# EAGLE design atum (EAGLE 6.5.0)
AUTHOR: Brad Campbell; REV: A; TITLE: Atum

## Sheet 1 of 2
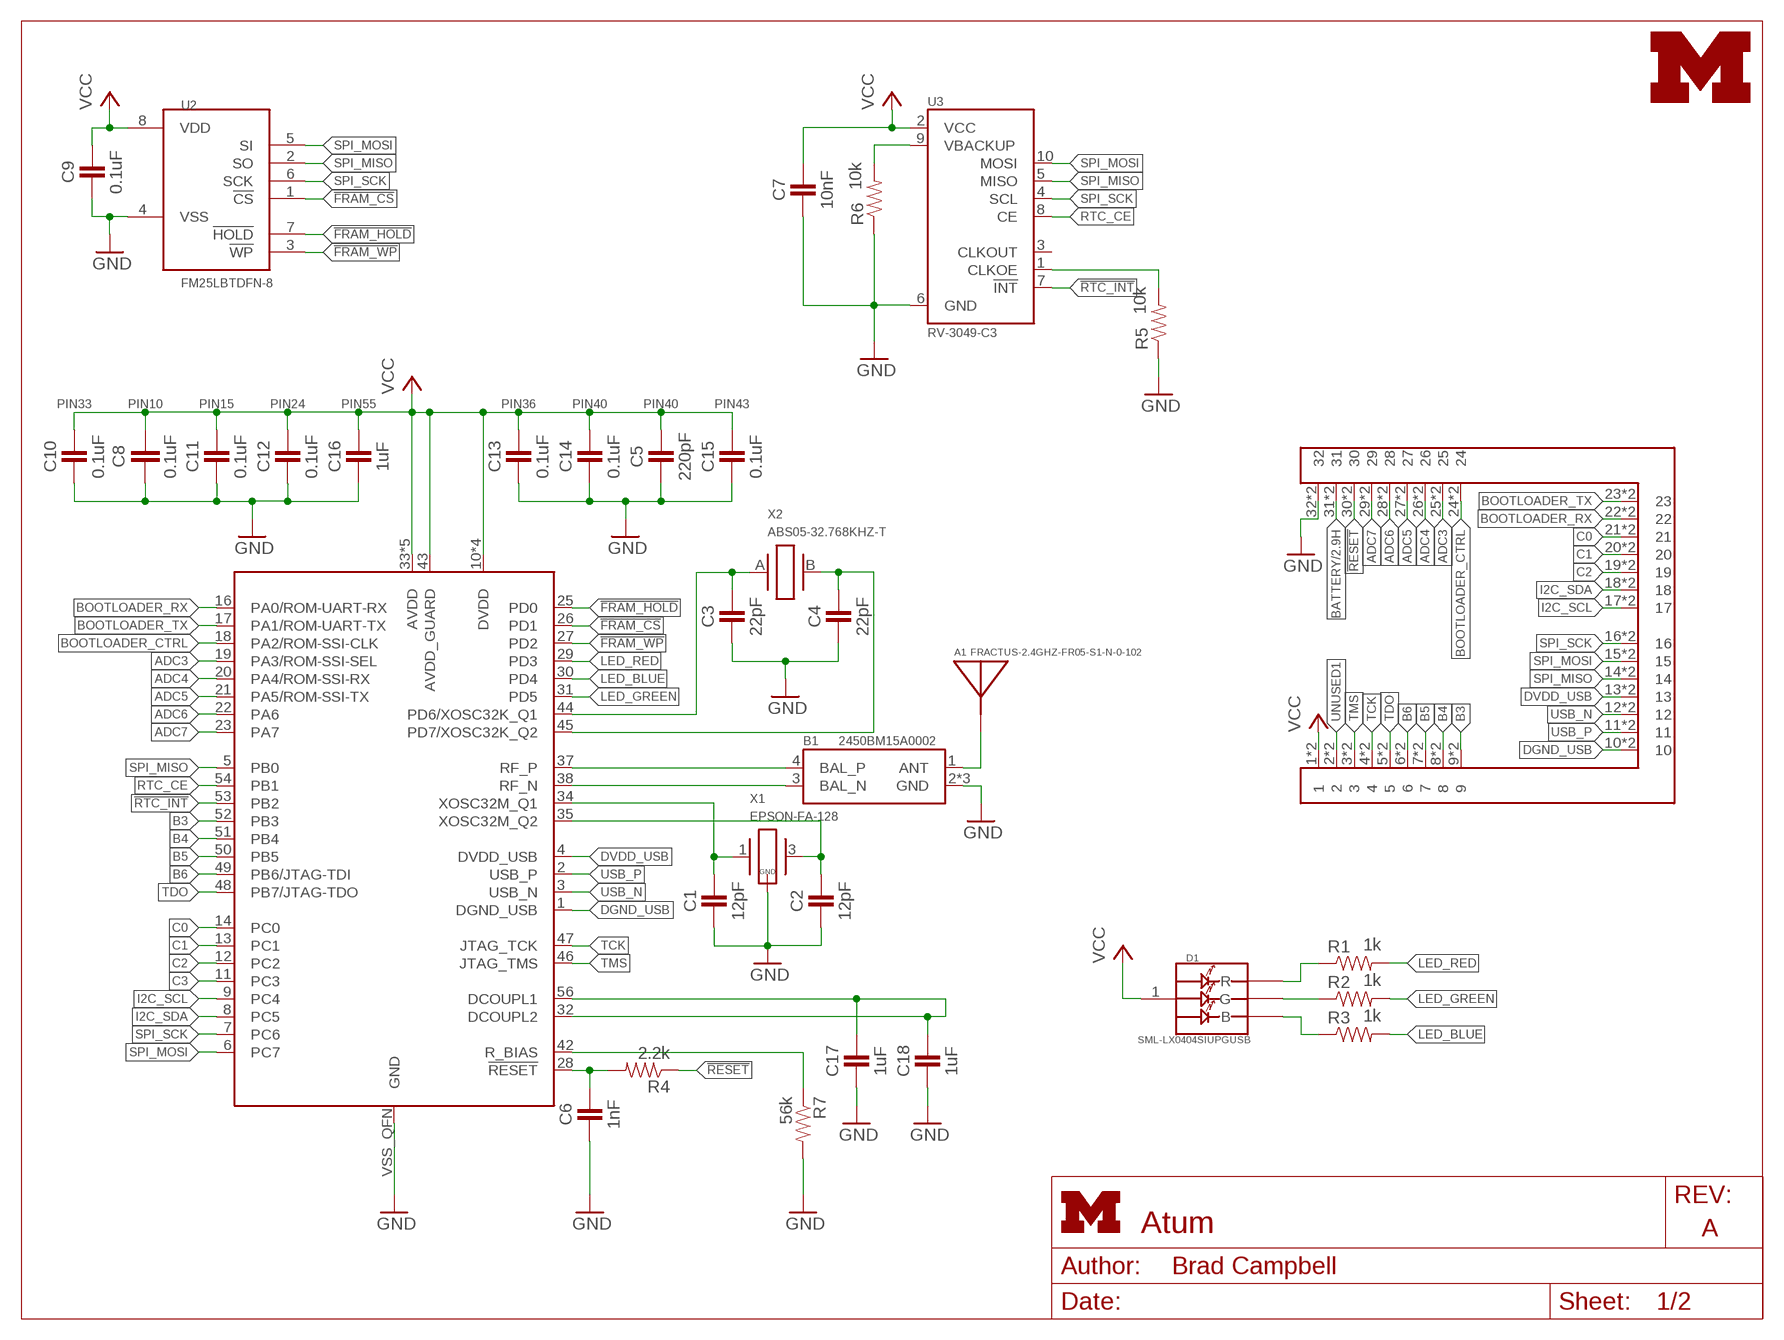
[diagram p0: schematic, sheet 1]
FRAME1 (LETTER_L): HEIGHT: 8.5in; WIDTH: 11in

### Parts
A1  FRACTUS-2.4GHZ-FR05-S1-N-0-102  [FRACTUS-ANTENNA-FR05-S1-N-0-102]
B1  2450BM15A0002  [2450BM]
C1  12pF  CAPACITOR  [0402_CAP]
C2  12pF  CAPACITOR  [0402_CAP]
C3  22pF  CAPACITOR  [0402_CAP]
C4  22pF  CAPACITOR  [0402_CAP]
C5  220pF  CAPACITOR  [0402_CAP]
C6  1nF  CAPACITOR  [0402_CAP]
C7  10nF  CAPACITOR  [0402_CAP]
C8  0.1uF  C-EUC0201  [C0201]
C9  0.1uF  CAPACITOR  [0402_CAP]
C10  0.1uF  CAPACITOR  [0402_CAP]
C11  0.1uF  CAPACITOR  [0402_CAP]
C12  0.1uF  CAPACITOR  [0402_CAP]
C13  0.1uF  CAPACITOR  [0402_CAP]
C14  0.1uF  CAPACITOR  [0402_CAP]
C15  0.1uF  CAPACITOR  [0402_CAP]
C16  1uF  CAPACITOR  [0402_CAP]
C17  1uF  CAPACITOR  [0402_CAP]
C18  1uF  CAPACITOR  [0402_CAP]
D1  SML-LX0404SIUPGUSB  [1MM_SQ_4PAD]
J3  ATUM-HEADER  [ATUM-HEADER]
LOGO1  UMICH_SOLID_TINY  [UMICH_SOLID_50MIL]
R1  1k  RESISTOR  [0402_RES]
R2  1k  RESISTOR  [0402_RES]
R3  1k  RESISTOR  [0402_RES]
R4  2.2k  RESISTOR  [0402_RES]
R5  10k  RESISTOR  [0402_RES]
R6  10k  RESISTOR  [0402_RES]
R7  56k  RESISTOR  [0402_RES]
U1  CC2538  [S-PVQFN-N56]
U2  FM25LBTDFN-8  [TDFN-8]
U3  RV-3049-C3  [MICRO-CRYSTAL-C3]
X1  EPSON-FA-128  [FA-128]
X2  ABS05-32.768KHZ-T  [ABS05]

### Nets
!FRAM_CS: U1.26(PD1) U2.1(!CS)
!FRAM_HOLD: U1.25(PD0) U2.7(!HOLD)
!FRAM_WP: U1.27(PD2) U2.3(!WP)
!RESET: J3.30 J3.30B R4.1
!RTC_INT: U1.53(PB2) U3.7(!INT)
ADC3: J3.25 J3.25B U1.19(PA3/ROM-SSI-SEL)
ADC4: J3.26 J3.26B U1.20(PA4/ROM-SSI-RX)
ADC5: J3.27 J3.27B U1.21(PA5/ROM-SSI-TX)
ADC6: J3.28 J3.28B U1.22(PA6)
ADC7: J3.29 J3.29B U1.23(PA7)
ANTENNA: A1.1(ANTENNA) B1.1(ANT)
B3: J3.9 J3.9B U1.52(PB3)
B4: J3.8 J3.8B U1.51(PB4)
B5: J3.7 J3.7B U1.50(PB5)
B6: J3.6 J3.6B U1.49(PB6/JTAG-TDI)
BATTERY: J3.31 J3.31B ; also sheet 2
BOOTLOADER_CTRL: J3.24 J3.24B U1.18(PA2/ROM-SSI-CLK)
BOOTLOADER_RX: J3.22 J3.22B U1.16(PA0/ROM-UART-RX)
BOOTLOADER_TX: J3.23 J3.23B U1.17(PA1/ROM-UART-TX)
C0: J3.21 J3.21B U1.14(PC0)
C1: J3.20 J3.20B U1.13(PC1)
C2: J3.19 J3.19B U1.12(PC2)
C3: U1.11(PC3)
DGND_USB: J3.10 J3.10B U1.1(DGND_USB)
DVDD_USB: J3.13 J3.13B U1.4(DVDD_USB)
GND: B1.2(GND) B1.5(GND) B1.6(GND) C1.2 C2.2 C3.2 C4.2 C5.2 C6.2 C7.2 C8.2 C9.2 C10.2 C11.2 C12.2 C13.2 C14.2 C15.2 C16.2 C17.2 C18.2 J3.32 J3.32B R5.1 R6.1 R7.2 U1.VSS_QFN(GND) U2.4(VSS) U3.6(GND) X1.2(GND) X1.4(GND) ; also sheet 2
I2C_SCL: J3.17 J3.17B U1.9(PC4)
I2C_SDA: J3.18 J3.18B U1.8(PC5)
LED_BLUE: R3.2 U1.30(PD4)
LED_GREEN: R2.2 U1.31(PD5)
LED_RED: R1.2 U1.29(PD3)
N$1: C6.1 R4.2 U1.28(!RESET)
N$6: C3.1 U1.44(PD6/XOSC32K_Q1) X2.A
N$7: D1.2(R) R1.1
N$8: R7.1 U1.42(R_BIAS)
N$9: C1.1 U1.34(XOSC32M_Q1) X1.1
N$10: C2.1 U1.35(XOSC32M_Q2) X1.3
N$11: D1.4(G) R2.1
N$12: D1.3(B) R3.1
N$13: C4.1 U1.45(PD7/XOSC32K_Q2) X2.B
N$14: R6.2 U3.9(VBACKUP)
N$15: C17.1 C18.1 U1.32(DCOUPL2) U1.56(DCOUPL1)
N$16: R5.2 U3.1(CLKOE)
RF_N: B1.3(BAL_N) U1.38(RF_N)
RF_P: B1.4(BAL_P) U1.37(RF_P)
RTC_CE: U1.54(PB1) U3.8(CE)
SPI_MISO: J3.14 J3.14B U1.5(PB0) U2.2(SO) U3.5(MISO)
SPI_MOSI: J3.15 J3.15B U1.6(PC7) U2.5(SI) U3.10(MOSI)
SPI_SCK: J3.16 J3.16B U1.7(PC6) U2.6(SCK) U3.4(SCL)
TCK: J3.4 J3.4B U1.47(JTAG_TCK)
TDO: J3.5 J3.5B U1.48(PB7/JTAG-TDO)
TMS: J3.3 J3.3B U1.46(JTAG_TMS)
UNUSED1: J3.2 J3.2B
USB_N: J3.12 J3.12B U1.3(USB_N)
USB_P: J3.11 J3.11B U1.2(USB_P)
VCC: C5.1 C7.1 C8.1 C9.1 C10.1 C11.1 C12.1 C13.1 C14.1 C15.1 C16.1 D1.1(VDD) J3.1 J3.1B U1.10(DVDD) U1.15(DVDD) U1.24(DVDD) U1.33(AVDD) U1.36(AVDD) U1.39(AVDD) U1.40(AVDD) U1.41(AVDD) U1.43(AVDD_GUARD) U1.55(DVDD) U2.8(VDD) U3.2(VCC) ; also sheet 2
Unconnected: U3.3(CLKOUT)

### Notes on the sheet
- PIN33 | PIN10 | PIN15 | PIN24 | PIN55 | PIN36 | PIN40 | PIN40 | PIN43

## Sheet 2 of 2
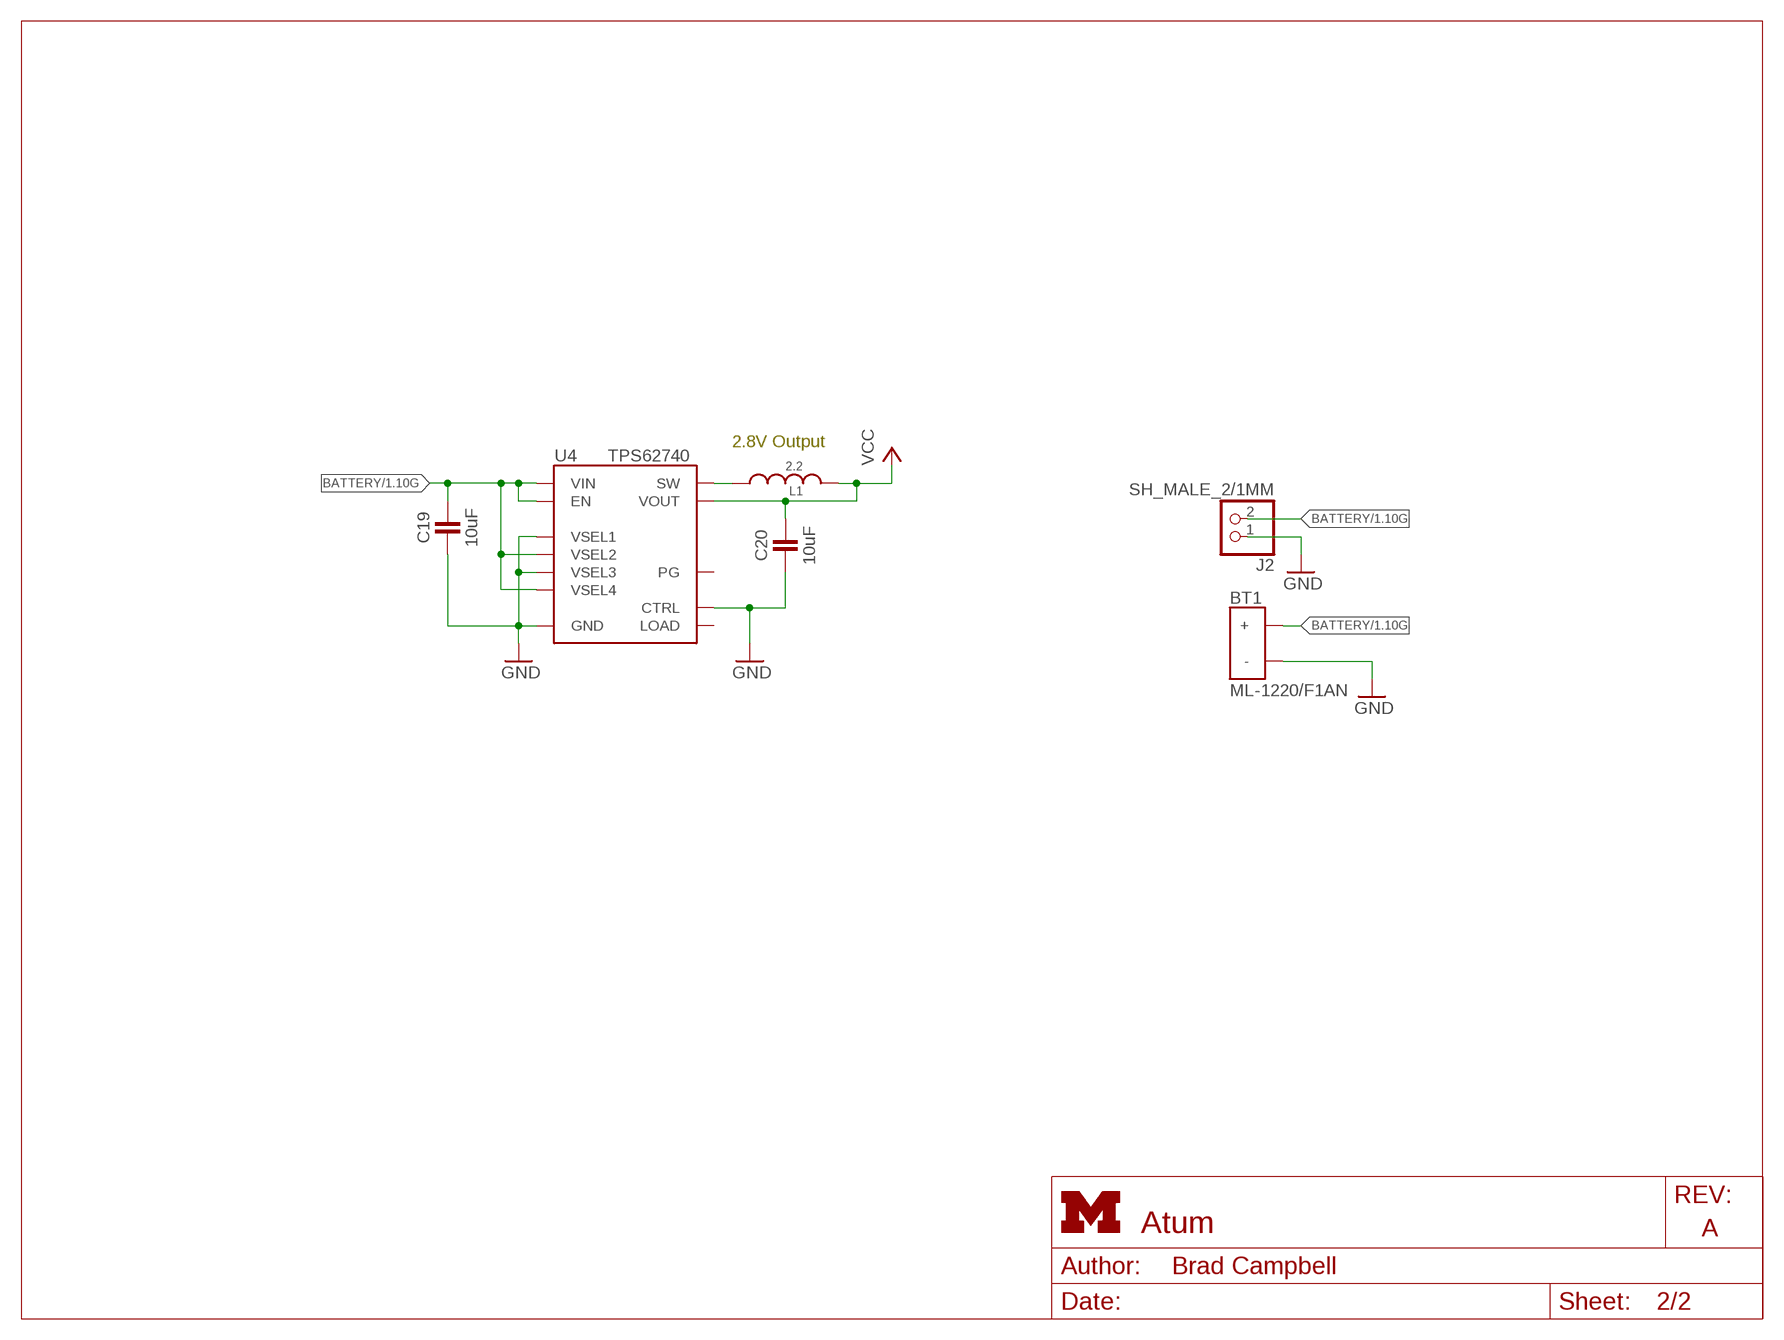
[diagram p1: schematic, sheet 2]
FRAME2 (LETTER_L): HEIGHT: 8.5in; WIDTH: 11in

### Parts
BT1  ML-1220/F1AN  [ML-1220/F1BN]
C19  10uF  CAPACITOR0603_CAP  [0603_CAP]
C20  10uF  CAPACITOR0603_CAP  [0603_CAP]
J2  SH_MALE_2/1MM  [SH-1X2/1MM]
L1  2.2  MIPSZ2012D  [MIPSZ201D]
U4  TPS62740  [R-PWSON-12]

### Nets
BATTERY: BT1.POS(+) C19.1 J2.2 U4.1(VIN) U4.8(VSEL4) U4.10(VSEL2) U4.12(EN) ; also sheet 1
GND: BT1.NEG(-) C19.2 C20.2 J2.1 U4.3(GND) U4.4(CTRL) U4.9(VSEL3) U4.11(VSEL1) U4.NC(GND) ; also sheet 1
N$5: L1.1 U4.2(SW)
VCC: C20.1 L1.2 U4.5(VOUT) ; also sheet 1
Unconnected: U4.6(LOAD) U4.7(PG)

### Notes on the sheet
- 2.8V Output

## Library data of the parts
A1 = chips:FRACTUS-2.4GHZ-FR05-S1-N-0-102: Fractus Compact Reach XtendTM chip antenna is engineered specifically for Bluetooth, WLAN 802.11 b/g/n and other wireless devices operating at the ISM 2.4 GHz band. Compact Reach Xtend combines small form factor size and high performance to improve the functionality of your wireless devices.; RICHARDSON_RFPD: FR05-S1-N-0102B
B1 = chips:2450BM15A0002: BALUN JTI MATCHED ZIGBEE; DIGIKEY: 712-1536-1-ND
BT1 = batteries:ML-1220/F1AN: BATTERY LITH 3V RECHARGE PC PINS; DIGIKEY: P663-nd; MOUSER: 658-ML-1220/F1BN
C1-C7 C9-C18 = passives:CAPACITOR: 0402 Capacitor
C8 = rcl:C-EU: CAPACITOR, European symbol
C19 C20 = passives:CAPACITOR: 0402 Capacitor; DIGIKEY: 490-7316-1-ND
D1 = leds:SML-LX0404SIUPGUSB: 1mm^2 RGB LED; DIGIKEY: 67-2125-1-ND
J2 = headers:SH_MALE_2/1MM: 1.0mm pitch/Disconnectable Crimp style connectors; DIGIKEY: 455-1788-2-ND
J3 = atum:ATUM-HEADER: Castellated header for the Atum board.
L1 = passives:MIPSZ2012D: FDK Multi-layer Power Inductor : MIPSZ2012D series (Very Small Type)
LOGO1 = logos:UMICH_SOLID
R1-R7 = passives:RESISTOR: Resistor Basic schematic elements and footprints for 0603, 1206, and PTH resistors.
U1 = chips:CC2538: A Powerful System-On-Chip for 2.4-GHz IEEE 802.15.4, 6LoWPAN and ZigBee Applications; DIGIKEY: 296-35797-1-ND; MOUSER: 595-CC2538SF53RTQT; NEWARK: 87W7713
U2 = chips:FM25LB: IC FRAM 4KBIT 10MHZ 8SOIC; DIGIKEY: FM25L04B-DGRA-ND; MOUSER: 877-FM25L04B-DG
U3 = chips:RV-3049-C3: The RV-3049-C3 is an ultra miniature Real-Time-Clock Module with embedded Crystal. This RTC has an SPI Bus (4-wire Serial- Interface) and offers temperature compensated time.
U4 = chips:TPS62740: 360nA Step Down Converter for Low Power Applications; DIGIKEY: 296-37134-1-ND; MOUSER: 595-TPS62740DSST; NEWARK: 27X9745
X1 = crystals:EPSON-FA-128: MHz RANGE CRYSTAL UNIT ULTRA MINIATURE SIZE LOW PROFILE SMD http://www.digikey.com/product-search/en?FV=ffec63d1
X2 = crystals:ABS05-32.768KHZ: 32.768kHz Crystal; DIGIKEY: 535-11899-1-ND

## Board
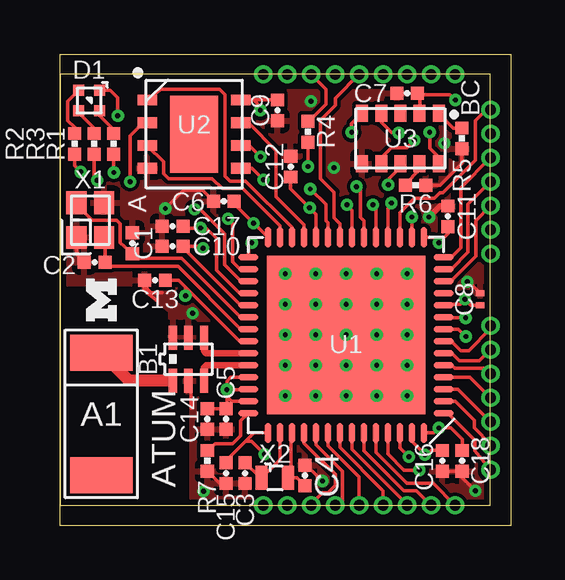
[diagram p2: board, top side]
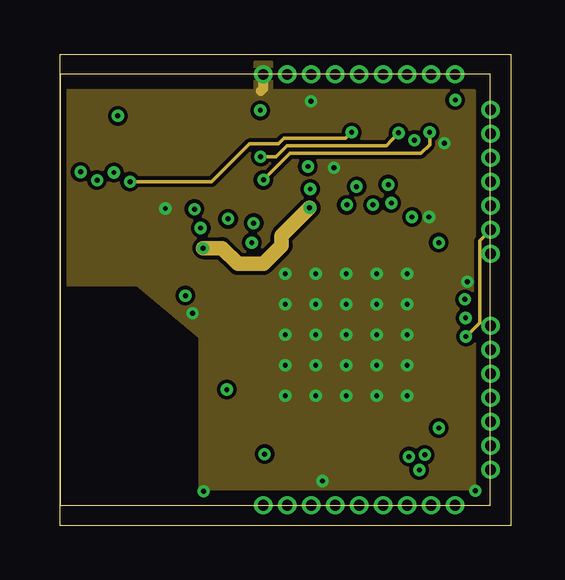
[diagram p3: board, inner layer Route2]
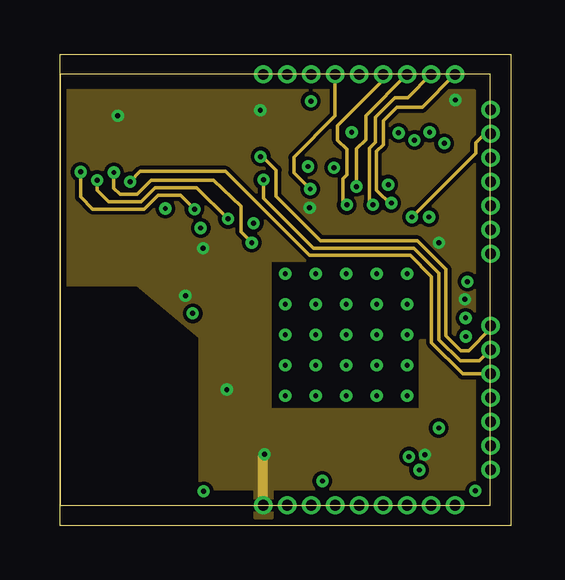
[diagram p4: board, inner layer Route15]
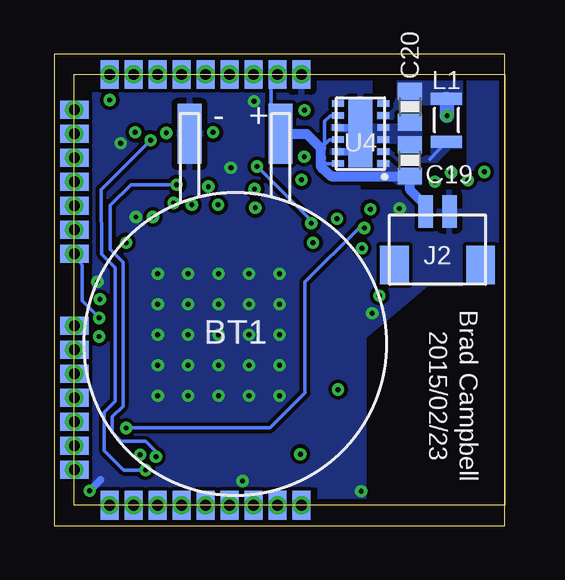
[diagram p5: board, bottom side, seen from below]

Size 17.96 x 17.96 mm. Coordinates in mm from the lower left corner, seen from the top.
Outline: 0,0 17.96,0 17.96,17.96 0,17.96 0,0
Copper layers (1+2*15+16): Top 0.035559375mm / dielectric 0.14478125mm / Route2 0.035559375mm / dielectric 22mil / Route15 0.035559375mm / dielectric 0.14478125mm / Bottom 0.035559375mm
Design rules "sunstone-4lyr_v1.0.0.3 *": minimum track width 6mil, minimum drill 4mil, track to track 6mil, track to pad 6mil, pad to pad 6mil, via to via 6mil, smd to smd 6mil, copper to edge 10mil, drill to drill 16mil, minimum pad ring 4mil, minimum via ring 6mil, stop-mask expansion 3mil, vias tented up to drill 8mil, thermal gap 10mil
Milling: 4 lines

### Footprints (pad centres in the part's own frame; a part is rotated, then mirrored left to right if it is on the bottom)
FRACTUS-ANTENNA-FR05-S1-N-0-102 = smd 1.5 x 2.6: 1 -2.55,0; 2 2.55,0
2450BM = smd 0.35 x 1: 1 0.65,0.9; 2 0,0.9; 3 -0.65,0.9; 4 -0.65,-0.9; 5 0,-0.9; 6 0.65,-0.9
ML-1220/F1BN = smd 2.5 x 1: NEG 8.75,1.9; POS 8.75,-1.9
0402_CAP = smd 0.536 x 0.546: 1 -0.433,0; 2 0.433,0
C0201 = smd 0.25 x 0.35: 1 -0.25,0; 2 0.25,0
0603_CAP = smd 0.7 x 1: 1 -0.65,0; 2 0.65,0
1MM_SQ_4PAD = smd 0.457 x 0.457: 1 0.432,0.432; 2 0.432,-0.432; 3 -0.432,-0.432; 4 -0.432,0.432
SH-1X2/1MM = smd 0.6 x 1.35: 1 -0.5,0.1; 2 0.5,0.1 | smd 1.2 x 1.6: SUPPORT1 -1.8,2.335; SUPPORT2 1.8,2.335
ATUM-HEADER = drill 0.45 pad 0.754: 1 -9.479,-8.979; 2 -8.479,-8.979; 3 -7.479,-8.979; 4 -6.479,-8.979; 5 -5.479,-8.979; 6 -4.479,-8.979; 7 -3.479,-8.979; 8 -2.479,-8.979; 9 -1.479,-8.979; 10 0,-7.5; 11 0,-6.5; 12 0,-5.5; 13 0,-4.5; 14 0,-3.5; 15 0,-2.5; 16 0,-1.5; 17 0,1.5; 18 0,2.5; 19 0,3.5; 20 0,4.5; 21 0,5.5; 22 0,6.5; 23 0,7.5; 24 -1.479,8.979; 25 -2.479,8.979; 26 -3.479,8.979; 27 -4.479,8.979; 28 -5.479,8.979; 29 -6.479,8.979; 30 -7.479,8.979; 31 -8.479,8.979; 32 -9.479,8.979 | smd 0.754 x 1.2 bottom: 1B -9.479,-8.979; 2B -8.479,-8.979; 3B -7.479,-8.979; 4B -6.479,-8.979; 5B -5.479,-8.979; 6B -4.479,-8.979; 7B -3.479,-8.979; 8B -2.479,-8.979; 9B -1.479,-8.979; 24B -1.479,8.979; 25B -2.479,8.979; 26B -3.479,8.979; 27B -4.479,8.979; 28B -5.479,8.979; 29B -6.479,8.979; 30B -7.479,8.979; 31B -8.479,8.979; 32B -9.479,8.979 | smd 1.2 x 0.754 bottom: 10B 0,-7.5; 11B 0,-6.5; 12B 0,-5.5; 13B 0,-4.5; 14B 0,-3.5; 15B 0,-2.5; 16B 0,-1.5; 17B 0,1.5; 18B 0,2.5; 19B 0,3.5; 20B 0,4.5; 21B 0,5.5; 22B 0,6.5; 23B 0,7.5
MIPSZ201D = smd 0.5 x 1.3: 1 -0.9,0; 2 0.9,0
0402_RES = smd 0.536 x 0.546: 1 -0.433,0; 2 0.433,0
S-PVQFN-N56 = smd 0.85 x 0.28: 1 -4.075,3.25; 2 -4.075,2.75; 3 -4.075,2.25; 4 -4.075,1.75; 5 -4.075,1.25; 6 -4.075,0.75; 7 -4.075,0.25; 8 -4.075,-0.25; 9 -4.075,-0.75; 10 -4.075,-1.25; 11 -4.075,-1.75; 12 -4.075,-2.25; 13 -4.075,-2.75; 14 -4.075,-3.25; 29 4.075,-3.25; 30 4.075,-2.75; 31 4.075,-2.25; 32 4.075,-1.75; 33 4.075,-1.25; 34 4.075,-0.75; 35 4.075,-0.25; 36 4.075,0.25; 37 4.075,0.75; 38 4.075,1.25; 39 4.075,1.75; 40 4.075,2.25; 41 4.075,2.75; 42 4.075,3.25 | smd 0.28 x 0.85: 15 -3.25,-4.075; 16 -2.75,-4.075; 17 -2.25,-4.075; 18 -1.75,-4.075; 19 -1.25,-4.075; 20 -0.75,-4.075; 21 -0.25,-4.075; 22 0.25,-4.075; 23 0.75,-4.075; 24 1.25,-4.075; 25 1.75,-4.075; 26 2.25,-4.075; 27 2.75,-4.075; 28 3.25,-4.075; 43 3.25,4.075; 44 2.75,4.075; 45 2.25,4.075; 46 1.75,4.075; 47 1.25,4.075; 48 0.75,4.075; 49 0.25,4.075; 50 -0.25,4.075; 51 -0.75,4.075; 52 -1.25,4.075; 53 -1.75,4.075; 54 -2.25,4.075; 55 -2.75,4.075; 56 -3.25,4.075 | smd 6.6 x 6.6: VSS_QFN 0,0
TDFN-8 = smd 0.45 x 0.8: 1 -1.425,-1.95; 2 -0.475,-1.95; 3 0.475,-1.95; 4 1.425,-1.95; 5 1.425,1.95; 6 0.475,1.95; 7 -0.475,1.95; 8 -1.425,1.95 | smd 3.2 x 2: NC 0,0
MICRO-CRYSTAL-C3 = smd 0.5 x 0.7: 1 -1.6,-1.05; 2 -0.8,-1.05; 3 0,-1.05; 4 0.8,-1.05; 5 1.6,-1.05; 6 1.6,1.05; 7 0.8,1.05; 8 0,1.05; 9 -0.8,1.05; 10 -1.6,1.05
R-PWSON-12 = smd 0.28 x 0.5: 1 -1.25,-0.95; 2 -0.75,-0.95; 3 -0.25,-0.95; 4 0.25,-0.95; 5 0.75,-0.95; 6 1.25,-0.95; 7 1.25,0.95; 8 0.75,0.95; 9 0.25,0.95; 10 -0.25,0.95; 11 -0.75,0.95; 12 -1.25,0.95 | smd 2.8 x 1: NC 0,0
FA-128 = smd 0.95 x 0.85: 1 -0.725,-0.575; 2 0.725,-0.575; 3 0.725,0.575; 4 -0.725,0.575
ABS05 = smd 0.5 x 1: A -0.55,0; B 0.55,0

### Placement (x,y rotation side)
A1  1.73,3.81 270 top
B1  5.36,6.09 180 top
BT1  11.25,6.73 90 bottom
C1  3.02,10.92 90 top
C2  1.45,10.13 180 top
C3  7.72,1.35 270 top
C4  10.21,1.24 90 top
C5  6.93,3.6 270 top
C6  6.83,12.67 180 top
C7  14.48,17.17 180 top
C8  17.53,8.59 90 top
C9  9.07,16.46 270 top
C10  4.7,10.79 180 top
C11  16.18,12.04 90 top
C12  9.62,14.12 90 top
C13  3.96,9.37 180 top
C14  6.15,3.6 270 top
C15  6.93,1.35 270 top
C16  15.95,1.85 270 top
C17  4.7,11.63 180 top
C18  16.77,1.85 270 top
C19  3.96,14.38 90 bottom
C20  3.96,16.61 270 bottom
D1  1.22,16.87 0 top
J2  2.82,12.34 180 bottom
J3  17.96,8.98 0 top
L1  2.44,16.05 90 bottom
LOGO1  1.73,8.56 90 top
R1  2.24,15.06 270 top
R2  0.61,15.06 270 top
R3  1.42,15.06 270 top
R4  10.34,15.57 270 top
R5  16.76,15.29 90 top
R6  14.83,13.34 180 top
R7  6.15,1.85 270 top
U1  11.93,7.09 180 top
U2  5.6,15.47 270 top
U3  14.2,15.29 180 top
U4  6.02,15.49 90 bottom
X1  1.27,11.89 270 top
X2  8.97,1.14 0 top

### Tracks (layer width: path | path; a pad name or v marks a point on that pad's centre or on a via)
!FRAM_CS
  Top 0.152: U1.26 9.68,11.58 7.75,13.51 7.09,13.51 6.88,13.72 6.88,17.12 6.66,17.35 4.23,17.35 U2.1
!FRAM_HOLD
  Top 0.152: U1.25 10.19,11.68 9.02,12.85 9.02,14.78 7.86,15.94 U2.7
!FRAM_WP
  Top 0.152: U2.3 4.32,14.32 4.32,13.82 4.52,13.61 6.35,13.61 6.76,13.21 7.62,13.21 9.18,11.65 U1.27
!RESET
  Top 0.152: R4.1 10.39,16 11.1,16.71 11.1,17.34 J3.30B
!RTC_INT  (via drill 0.2)
  Top 0.152: U1.53 13.68,2.14 14.35,1.47 v14.99,1.47 | U3.7 13.4,14.49 13.82,14.91 14.48,14.91 v14.78,15.21
  Bottom 0.152: v14.78,15.21 16.84,13.16 16.82,10.46 16.26,9.91 16.26,4.34 16.71,3.89 16.71,2.29 15.9,1.47 v14.99,1.47
ADC3  (via drill 0.2)
  Top 0.152: U1.19 13.18,12.4 v13.06,12.52
  Route15 0.152: v13.06,12.52 12.9,12.68 12.9,14.88 13.16,15.14 13.16,16.18 13.97,16.99 14.51,16.99 J3.25B
ADC4  (via drill 0.2)
  Top 0.152: U1.20 12.68,11.86 12.52,12.01 12.52,13.13 v12.37,13.28
  Route15 0.152: v12.37,13.28 12.37,14.86 12.75,15.24 12.75,16.23 J3.26
ADC5  (via drill 0.2)
  Top 0.152: U1.21 12.18,12.31 v11.96,12.52
  Route15 0.152: v11.96,12.52 11.81,12.68 11.81,13.61 11.96,13.77 11.96,14.83 11.58,15.21 11.58,15.82 13.48,17.72 J3.27
ADC6
  Top 0.152: U1.22 11.68,11.74 11.43,11.99 11.43,13.06 10.87,13.61 10.87,16.05 11.48,16.66 11.48,16.96 J3.28
ADC7  (via drill 0.2)
  Top 0.152: U1.23 11.18,11.78 11.1,11.86 11.1,12.55 v10.44,13.18
  Route15 0.152: v10.44,13.18 9.75,13.87 9.75,14.5 11.48,16.23 J3.29
ANTENNA
  Top 0.254: B1.1 4.56,5.19
  Top 0.5: A1.1 2.89,5.19 4.56,5.19
B3
  Top 0.152: U1.52 13.18,2.21 14.48,0.91 15.56,0.91 J3.9B
B4
  Top 0.152: U1.51 12.68,2.28 14.35,0.61 14.87,0.61 J3.8B
B5
  Top 0.152: U1.50 12.18,2.35 14.48,0.05 J3.7
B6
  Top 0.152: U1.49 11.68,2.42 13.48,0.62 J3.6
BATTERY
  Bottom 0.152: U4.10 7.31,15.24 7.49,15.06 | U4.12 7.44,14.24 7.67,14.48 | 7.49,15.06 7.67,14.88 | U4.8 7.28,16.24 7.52,16 7.52,15.09 7.49,15.06 | BT1.POS 9.35,16.21 9.75,16.61 9.75,17.82 J3.31B
  Bottom 0.406: BT1.POS 8.27,15.48 7.67,14.88 7.67,14.48 7.67,14.1 7.26,13.72 3.97,13.72 C19.1 3.96,13.16 3.32,12.51 J2.2
  pour Bottom (no thermals): 3.48,13.34 3.48,14.05 4.47,14.05 4.85,14.4 5.33,14.4 5.33,14.1 5.03,13.79 4.5,13.34
BOOTLOADER_CTRL  (via drill 0.2)
  Top 0.152: U1.18 13.68,12.36 v13.82,12.6
  Route15 0.152: v13.82,12.6 13.82,12.52 13.21,13.13 13.21,14.76 13.49,15.04 13.49,16.02 14.05,16.59 15.11,16.59 J3.24B
BOOTLOADER_RX  (via drill 0.2)
  Top 0.152: U1.16 14.68,11.89 v14.68,12.01
  Route15 0.152: J3.22 17.71,15.48 17.35,15.11 17.35,14.68 v14.68,12.01
BOOTLOADER_TX
  Top 0.152: U1.17 14.18,12.2 14.78,12.8 15.62,12.8 15.85,13.03 15.98,13.03 17.32,14.38 17.32,16.03 17.77,16.48 J3.23B
C0
  Top 0.152: 16.05,10.35 U1.14 16.31,10.35 16.71,10.74 16.71,13.23 J3.21
C1
  Top 0.152: U1.13 16.32,9.85 17.02,10.54 17.02,12.54 J3.20
C2
  Top 0.152: U1.12 16.31,9.35 17.35,10.38 17.35,11.87 J3.19
DGND_USB
  Top 0.152: 16.35,3.85 U1.1 16.17,3.85 17.3,2.72 17.3,2.27 J3.10B
DVDD_USB
  Top 0.152: U1.4 17.09,5.34 J3.13
GND  (via drill 0.2)
  Top 0.152: C2.2 0.69,10.45 X1.2 | C16.2 C18.2 16.77,1.16 v17.32,0.61 | R6.1 15.85,13.34 16.76,14.25 R5.1 16.82,14.94 | 16.23,12.5 C11.2 | B1.2 5.46,5.09 5.46,4.04 | C15.2 6.66,0.91 R7.2 | v10.95,1.02 10.39,1.58 C4.2 | C6.2 5.94,13.13 5.16,13.13 v4.39,12.37 | C8.2 17.07,9.29 v17,9.32 | 4.01,8.56 3.5,8.97 C13.2 3.53,9.14 3.81,8.87 4.27,8.87 | v11.94,7.11 v11.94,7.1 U1.VSS_QFN
  Top 0.254: v15.39,12.01 15.85,12.47 C11.2
  Top 0.305: 16.08,12.47 C11.2
  Route2 0.406: J3.32 8.48,17.37 8.38,17.27
  Bottom 0.305: U4.9 6.27,15.74 U4.NC | 5.77,15.74 U4.NC | U4.11 6.34,14.74 6.02,15.06 U4.NC | v17.32,0.61 16.87,1.07
  other vias: 13.21,7.11 14.48,7.11 11.94,8.38 11.94,9.65 13.21,8.38 14.48,8.38 13.21,9.65 14.48,9.65 9.4,8.38 9.4,9.65 10.67,8.38 10.67,9.65 10.67,7.11 9.4,7.11 9.4,5.84 9.4,4.57 10.67,4.57 10.67,5.84 11.94,4.57 11.94,5.84 13.21,4.57 13.21,5.84 14.48,4.57 14.48,5.84 5.54,8 10.46,16.84 11.43,14.07 5.99,0.58 16.03,15.09
  pour Top: 0,17.27 17.96,17.27 17.96,0 5.46,0 5.46,4.7 5.21,4.7 5.21,5.59 6.32,5.59 6.32,5.28 8.26,5.31 8.26,3.43 15.62,3.43 15.62,10.79 8.26,10.79 8.26,6.99 4.57,6.99 4.57,8.08 3.23,9.19 0,9.19
  pour Bottom: 5.59,17.96 8.79,17.96 8.79,17.14 17.14,17.14 17.14,0.81 7.75,0.81 7.75,0 5.84,0 5.84,7.01 3.23,9.19 0,9.19 0,18.03 1.52,18.03 1.52,13.08 6.1,13.08 6.1,16.76 5.59,16.76
  pour Route2 (no thermals): 0,17.27 8.13,17.27 8.13,18.47 8.81,18.47 8.81,17.27 17.27,17.27 17.27,0.69 5.84,0.69 5.84,7.01 3.23,9.19 0,9.19
  pour Bottom (no thermals): 3.45,15.9 6.1,15.9 6.1,15.06 3.45,15.06
I2C_SCL  (via drill 0.2)
  Top 0.152: U1.9 16.04,7.81 v16.92,7.81
  Bottom 0.152: J3.17 17.63,10.02 17.63,8.52 v16.92,7.81
I2C_SDA  (via drill 0.2)
  Top 0.152: v16.93,7.04 16.62,7.34 U1.8
  Route2 0.152: v16.93,7.04 17.5,7.61 17.5,11.02 J3.18
LED_BLUE  (via drill 0.2)
  Top 0.152: U1.30 7.5,9.85 7.19,10.16 7.19,11.76 v7.01,11.94 | R3.2 1.42,13.68 v1.55,13.55
  Route15 0.152: v7.01,11.94 5.69,13.23 3.96,13.23 3.38,12.65 2.03,12.65 1.55,13.13 v1.55,13.55
LED_GREEN  (via drill 0.2)
  Top 0.152: U1.31 7.55,9.35 6.86,10.03 6.86,11.33 5.84,12.34 v5.61,12.34 | R2.2 0.61,14.15 v0.86,13.89
  Route15 0.152: v5.61,12.34 5.03,12.93 4.09,12.93 3.5,12.34 1.37,12.34 0.86,12.85 v0.86,13.89
LED_RED  (via drill 0.2)
  Top 0.152: U1.29 7.86,10.8 v8,10.95 | v2.25,13.87 R1.2
  Route15 0.152: v8,10.95 7.54,11.4 7.54,12.47 6.4,13.54 3.81,13.54 3.23,12.95 2.52,12.95 2.25,13.22 v2.25,13.87
N$1  (via drill 0.2)
  Top 0.152: U1.28 v8.09,11.76 v8.08,11.76 7.29,12.55 C6.1 | R4.2 v10.34,14.12
  Bottom 0.152: v8.08,11.76 8.08,11.86 v10.34,14.12
N$5
  Bottom 0.152: 3.14,14.43 L1.1
  pour Bottom (no thermals): 5.33,14.88 4.85,14.88 4.47,14.58 3.1,14.58 3.1,15.39 1.78,15.34 1.78,14.86 2.26,14.86 2.84,14.27 4.42,14.27 4.8,14.58 5.33,14.58
N$6
  Top 0.152: C3.1 8.36,1.14 X2.A 9.18,1.91 U1.44
N$7
  Top 0.152: D1.2 1.65,16.23 2.23,15.65 R1.1
N$8
  Top 0.152: R7.1 6.15,2.23 6.48,2.56 7.2,2.56 7.53,2.9 7.53,3.52 U1.42
N$9
  Top 0.152: 7.83,7.87 U1.34 7.52,7.84 5.08,10.29 3.17,10.29 C1.1 2.52,10.95 2.52,11.73 2.36,11.89 1.34,11.89 0.77,12.46 X1.1
N$10
  Top 0.152: X1.3 1.88,11.12 C2.1 2.06,9.96 4.93,9.96 7.54,7.34 U1.35
N$11
  Top 0.152: D1.4 0.33,16.84 0.33,16.03 0.61,15.75 R2.1
N$12
  Top 0.152: D1.3 0.79,16.36 1.42,15.72 R3.1
N$13
  Top 0.152: U1.45 9.63,2.97 9.63,1.25 X2.B 9.88,1.14 C4.1
N$14
  Top 0.152: U3.9 15,13.98 14.4,13.38 R6.2
N$15  (via drill 0.2)
  Top 0.152: U1.32 7.49,8.85 6.53,9.8 6.53,11.12 6.1,11.56 v5.87,11.56 5.21,11.56 C17.1 5.21,11.63 | U1.56 15.59,3.02 v15.8,3.23 16.31,3.23 16.77,2.76 C18.1
  Bottom 0.152: v15.8,3.23 9.8,3.23 8.33,4.7 8.33,9.32 6.1,11.56 v5.87,11.56
N$16
  Top 0.152: 15.87,16.34 U3.1 16.42,15.72 R5.2
RF_N
  Top 0.277: B1.3 6.01,5.75 6.1,5.84 U1.38
RF_P
  Top 0.277: B1.4 6.01,6.44 6.1,6.34 U1.37
RTC_CE  (via drill 0.2)
  Top 0.152: U3.8 14.19,14.09 13.69,13.59 v13.69,13.36 | U1.54 14.18,2.41 v14.55,2.03
  Bottom 0.152: v13.69,13.36 15.6,13.36 16.46,12.5 16.46,10.67 15.93,10.13 15.93,4.14 16.38,3.68 16.38,3.05 16,2.67 14.99,2.67 14.55,2.23 v14.55,2.03
SPI_MISO  (via drill 0.2)
  Top 0.152: U1.5 16.33,5.84 16.46,5.71 17.72,5.71 J3.14B | U2.2 3.47,15.94 2.92,15.39 v2.92,13.49 | U3.5 12.17,15.91 v12.17,15.54
  Route2 0.152: v2.92,13.49 6.33,13.49 7.9,15.06 9.12,15.06 9.35,15.29 11.91,15.29 v12.17,15.54
  Route15 0.152: v2.92,13.49 3.35,13.92 6.91,13.92 10.41,10.41 14.61,10.41 15.49,9.53 15.49,6.78 16.8,5.48 J3.14B
SPI_MOSI  (via drill 0.2)
  Top 0.152: U2.5 7.9,14.04 | 7.93,14.04 U2.5 | v8.48,13.56 8,14.04 U2.5 | 16.31,6.34 U1.6 16.34,6.34 16.66,6.02 17.5,6.02 J3.15B | U3.10 15.8,14.5 15.42,14.88 v15.42,15.54
  Route2 0.152: v8.48,13.56 9.6,14.68 15.06,14.68 15.42,15.04 v15.42,15.54
  Route15 0.152: v8.48,13.56 8.48,12.8 10.57,10.72 14.76,10.72 15.8,9.68 15.8,6.91 16.69,6.02 17.5,6.02 J3.15B
SPI_SCK  (via drill 0.2)
  Top 0.152: 7.87,14.99 U2.6 7.9,14.99 v8.37,14.53 | 16.29,6.84 U1.7 16.32,6.84 16.71,6.45 17.04,6.45 17.96,7.37 J3.16 | U3.4 13.4,15.96 13.84,15.52 v14.12,15.52
  Route2 0.152: v14.12,15.52 13.61,14.99 9.47,14.99 9.02,14.53 v8.37,14.53
  Route15 0.152: v8.37,14.53 8.46,14.53 9.02,13.97 9.02,12.88 10.87,11.02 14.91,11.02 16.1,9.83 16.1,7.06 16.71,6.45 17.04,6.45 17.96,7.37 J3.16
TCK
  Top 0.152: U1.47 10.68,2.53 11.79,1.42 11.79,0.11 11.55,-0.13 J3.4
TDO
  Top 0.152: U1.48 11.18,2.48 12.48,1.19 J3.5
TMS
  Top 0.152: 10.18,2.72 U1.46 | 10.18,2.75 U1.46 | 10.18,2.67 U1.46 | J3.3 10.48,0.07 10.95,0.53 11.18,0.53 11.48,0.84 11.48,1.29 10.18,2.6 U1.46
USB_N
  Top 0.152: U1.3 16.59,4.84 J3.12B
USB_P
  Top 0.152: U1.2 16.48,4.34 17.27,3.56 17.27,3.23 17.96,2.54 J3.11
VCC  (via drill 0.2)
  Top 0.152: C14.1 C5.1 6.96,4.06 v6.96,4.83 | U1.41 7.16,4.34 6.96,4.55 v6.96,4.83 | U1.39 7.12,5.34 6.96,5.18 v6.96,4.83 | U1.40 7.84,4.83 v6.96,4.83 | C15.1 6.97,1.9 7.74,2.67 | 7.74,2.67 8.09,3.02 U1.43 | U1.15 15.58,11.17 v15.8,10.95 16.18,11.33 C11.1 16.31,11.46 | v8.53,2.13 8,2.67 7.74,2.67 | U1.10 16.04,8.38 16.69,8.38 v16.89,8.59 17.14,8.34 C8.1 | U3.2 15.01,16.35 15.01,17.07 C7.1 | U1.55 14.68,2.67 15.24,2.11 v15.21,2.11 15.49,2.29 C16.1 | U1.36 7.48,6.84 5.23,9.09 | C13.1 4.95,9.37 5.23,9.09 | U1.33 7.53,8.35 5.13,10.74 C10.1 5.89,10.79 v5.97,10.72 | 5.23,9.09 v5.23,8.74 | U1.24 10.68,12.13 v10.41,12.39 9.62,13.19 C12.1 | C7.1 15.06,17.2 | C7.1 15.14,17.12 16.26,17.12 v16.48,16.89 | D1.1 2.09,17.3 2.41,16.98 v2.41,16.23 | U2.8 8.08,16.89 | 8.08,16.89 9.02,16.89 9.14,17.02 9.14,16.97 C9.1 | v8.36,16.46 8.36,16.61 8.08,16.89
  Route2 0.61: v5.97,10.72 6.76,10.72 7.42,10.06 8.48,10.06 9.25,10.82 9.25,11.23 v10.41,12.39
  Route15 0.406: J3.1B 8.48,2.08 v8.53,2.13
  Bottom 0.61: L1.2 2.41,16.93 v2.41,16.23
  pour Route15 (no thermals): 0,17.27 17.27,17.27 17.27,6.35 17.02,6.35 16,7.37 14.99,7.37 14.99,10.21 8.76,10.21 8.76,3.99 15.04,3.99 15.04,6.86 15.75,6.86 17.27,5.49 17.27,0.69 8.84,0.69 8.84,-0.51 8.13,-0.51 8.13,0.69 5.84,0.69 5.84,7.01 3.23,9.19 0,9.19
  pour Bottom (no thermals): 5.33,16.08 4.67,16.08 4.34,16.66 1.75,16.66 1.75,17.7 4.5,17.7 4.5,17.07 4.8,16.41 5.33,16.41

### Text on the board
tPlace: BC | A | ATUM
bPlace: + | - | Brad Campbell | 2015/02/23